# Altium schematic sheet 4.Interface2.SchDoc
size A4; DocumentNumber: 5; SheetNumber: 5; SheetTotal: 6
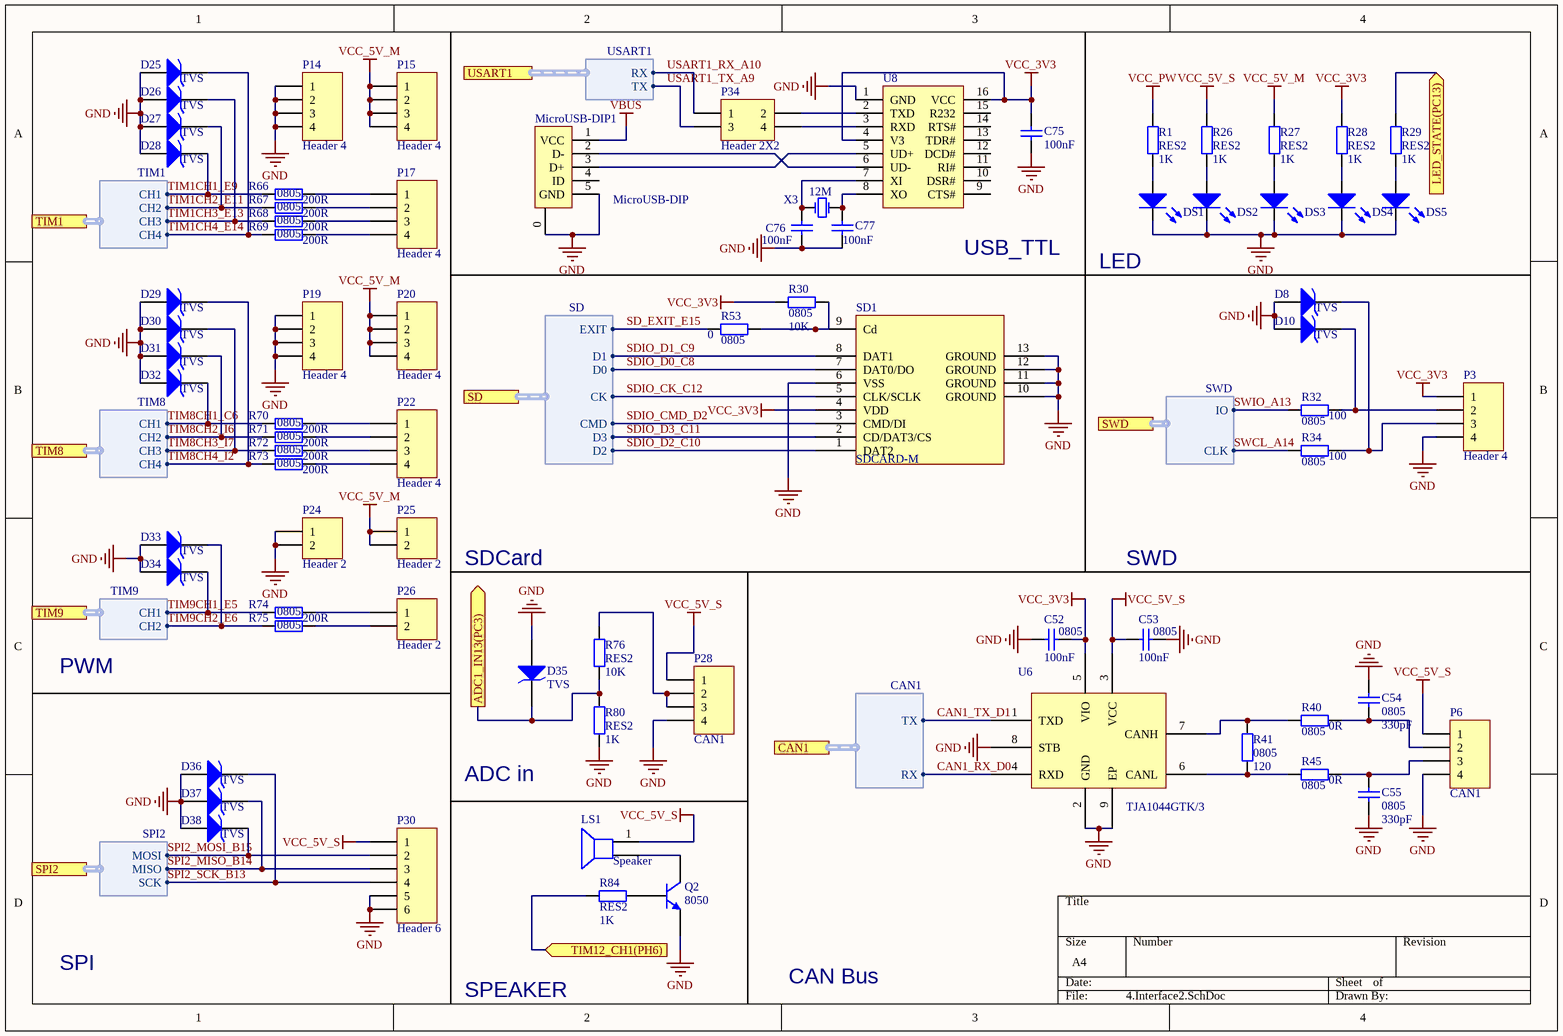
[diagram p0: 4.Interface2.SchDoc]

## Parts
C52  0805  value 100nF  [C 0805_M]
C53  0805  value 100nF  [C 0805_M]
C54  0805  value 330pF  [C 0805_M]
C55  0805  value 330pF  [C 0805_M]
C75  value 100nF  [C 0805_L]  (hidden comment: CAP)
C76  value 100nF  [C 0805_L]  (hidden comment: CAP)
C77  value 100nF  [C 0805_L]  (hidden comment: CAP)
D8  TVS  [SOD-523]
D10  TVS  [SOD-523]
D25  TVS  [SOD-523]
D26  TVS  [SOD-523]
D27  TVS  [SOD-523]
D28  TVS  [SOD-523]
D29  TVS  [SOD-523]
D30  TVS  [SOD-523]
D31  TVS  [SOD-523]
D32  TVS  [SOD-523]
D33  TVS  [SOD-523]
D34  TVS  [SOD-523]
D35  TVS  [SOD-523]
D36  TVS  [SOD-523]
D37  TVS  [SOD-523]
D38  TVS  [SOD-523]
DS1  LED  [LED 0805B]  (value not drawn)
DS2  LED  [LED 0805B]  (value not drawn)
DS3  LED  [LED 0805B]  (value not drawn)
DS4  LED  [LED 0805B]  (value not drawn)
DS5  LED  [LED 0805B]  (value not drawn)
LS1  Speaker  [BEEP 5x9x5.5]
MicroUSB-DIP1  MicroUSB-DIP  [MICRO_USB_DIP]
P3  Header 4  [KF2EDGK-2.54-WI-4P]
P6  CAN1  [KF2EDGK-2.54-WI-4P]
P14  Header 4  [HDR2.54-LI-4P]
P15  Header 4  [HDR2.54-LI-4P]
P17  Header 4  [HDR2.54-LI-4P]
P19  Header 4  [HDR2.54-LI-4P]
P20  Header 4  [HDR2.54-LI-4P]
P22  Header 4  [HDR2.54-LI-4P]
P24  Header 2  [HDR2.54-LI-2P]
P25  Header 2  [HDR2.54-LI-2P]
P26  Header 2  [HDR2.54-LI-2P]
P28  CAN1  [KF2EDGK-2.54-WI-4P]
P30  Header 6  [KF2EDGK-2.54-WI-6P]
P34  Header 2X2  [HDR2.54-LI-2x2P]
Q2  8050  [SOT23-3L]
R1  RES2  value 1K  [R 0805_L]
R26  RES2  value 1K  [R 0805_L]
R27  RES2  value 1K  [R 0805_L]
R28  RES2  value 1K  [R 0805_L]
R29  RES2  value 1K  [R 0805_L]
R30  0805  value 10K  [R 0805_L]
R32  0805  value 100  [R 0805_L]
R34  0805  value 100  [R 0805_L]
R40  0805  value 0R  [R 0805_L]
R41  0805  value 120  [R 0805_L]
R45  0805  value 0R  [R 0805_L]
R53  0805  value 0  [R 0805_L]
R66  0805  value 200R  [R 0805_L]
R67  0805  value 200R  [R 0805_L]
R68  0805  value 200R  [R 0805_L]
R69  0805  value 200R  [R 0805_L]
R70  0805  value 200R  [R 0805_L]
R71  0805  value 200R  [R 0805_L]
R72  0805  value 200R  [R 0805_L]
R73  0805  value 200R  [R 0805_L]
R74  0805  value 200R  [R 0805_L]
R75  0805  [R 0805_L]
R76  RES2  value 10K  [R 0805_L]
R80  RES2  value 1K  [R 0805_L]
R84  RES2  value 1K  [R 0805_L]
SD1  SDCARD-M  [SDCARD-M]
U6  TJA1044GTK/3  [HVSON8]
U8  CH340G  [SOP16_M]  (value not drawn)
X3  12M  [OSC HC-49S]

## Ports
ADC1_IN13(PC3) (out), CAN1 (harness CAN1), LED_STATE(PC13) (in), SD (harness SD), SPI2 (harness SPI2), SWD (harness SWD), TIM1 (harness TIM1), TIM8 (harness TIM8), TIM9 (harness TIM9), TIM12_CH1(PH6) (in), USART1 (harness USART1)

## Harnesses
TIM1: CH1, CH2, CH3, CH4
TIM8: CH1, CH2, CH3, CH4
USART1: RX, TX
TIM9: CH1, CH2
SPI2: MOSI, MISO, SCK
SD: EXIT, D1, D0, CK, CMD, D3, D2
SWD: IO, CLK
CAN1: TX, RX

## Nets
GND: C52.1 C53.2 C54.2 C55.1 C75.1 C76.1 C77.1 D8.1(A) D10.1(A) D25.1(A) D26.1(A) D27.1(A) D28.1(A) D29.1(A) D30.1(A) D31.1(A) D32.1(A) D33.1(A) D34.1(A) D35.1(A) D36.1(A) D37.1(A) D38.1(A) DS1.2(K) DS2.2(K) DS3.2(K) DS4.2(K) DS5.2(K) MicroUSB-DIP1.0 MicroUSB-DIP1.5(GND) P3.4 P6.4 P14.1 P14.2 P14.3 P14.4 P19.1 P19.2 P19.3 P19.4 P24.1 P24.2 P28.4 P30.5 P30.6 Q2.2(E) R80.1 SD1.6(VSS) SD1.10(GROUND) SD1.11(GROUND) SD1.12(GROUND) SD1.13(GROUND) U6.2(GND) U6.8(STB) U6.9(EP) U8.1(GND)
VBUS: MicroUSB-DIP1.1(VCC)
VCC_3V3: C52.2 C75.2 P3.1 R28.2 R30.2 SD1.4(VDD) U6.5(VIO) U8.4(V3) U8.16(VCC)
VCC_5V_M: P15.1 P15.2 P15.3 P15.4 P20.1 P20.2 P20.3 P20.4 P25.1 P25.2 R27.2
VCC_5V_S: C53.1 LS1.1 P6.1 P28.1 P30.1 R26.2 U6.3(VCC)
VCC_PW: R1.2
ADC1_IN13(PC3): D35.2(K) R76.1 R80.2 ; port ADC1_IN13(PC3)
CAN1_RX_D0: U6.4(RXD) ; port CAN1.RX
CAN1_TX_D1: U6.1(TXD) ; port CAN1.TX
LED_STATE(PC13): R29.2 ; port LED_STATE(PC13)
SD_EXIT_E15: R53.1 ; port SD.EXIT
SDIO_CK_C12: SD1.5(CLK/SCLK) ; port SD.CK
SDIO_CMD_D2: SD1.3(CMD/DI) ; port SD.CMD
SDIO_D0_C8: SD1.7(DAT0/DO) ; port SD.D0
SDIO_D1_C9: SD1.8(DAT1) ; port SD.D1
SDIO_D2_C10: SD1.1(DAT2) ; port SD.D2
SDIO_D3_C11: SD1.2(CD/DAT3/CS) ; port SD.D3
SPI2_MISO_B14: D37.2(K) P30.3 ; port SPI2.MISO
SPI2_MOSI_B15: D38.2(K) P30.2 ; port SPI2.MOSI
SPI2_SCK_B13: D36.2(K) P30.4 ; port SPI2.SCK
SWCL_A14: R34.1 ; port SWD.CLK
SWIO_A13: R32.1 ; port SWD.IO
TIM1CH1_E9: D28.2(K) R66.1 ; port TIM1.CH1
TIM1CH2_E11: D27.2(K) R67.1 ; port TIM1.CH2
TIM1CH3_E13: D26.2(K) R68.1 ; port TIM1.CH3
TIM1CH4_E14: D25.2(K) R69.1 ; port TIM1.CH4
TIM8CH1_C6: D32.2(K) R70.1 ; port TIM8.CH1
TIM8CH2_I6: D31.2(K) R71.1 ; port TIM8.CH2
TIM8CH3_I7: D30.2(K) R72.1 ; port TIM8.CH3
TIM8CH4_I2: D29.2(K) R73.1 ; port TIM8.CH4
TIM9CH1_E5: D34.2(K) R74.1 ; port TIM9.CH1
TIM9CH2_E6: D33.2(K) R75.1 ; port TIM9.CH2
TIM12_CH1(PH6): R84.2 ; port TIM12_CH1(PH6)
USART1_RX_A10: P34.1 ; port USART1.RX
USART1_TX_A9: P34.3 ; port USART1.TX
NetC54_1: C54.1 P6.2 R40.1
NetC55_2: C55.2 P6.3 R45.1
NetC76_2: C76.2 U8.7(XI) X3.1(OSC1)
NetC77_2: C77.2 U8.8(XO) X3.2(OSC2)
NetD8_2: D8.2(K) P3.3 R34.2
NetD10_2: D10.2(K) P3.2 R32.2
NetDS1_1: DS1.1(A) R1.1
NetDS2_1: DS2.1(A) R26.1
NetDS3_1: DS3.1(A) R27.1
NetDS4_1: DS4.1(A) R28.1
NetDS5_1: DS5.1(A) R29.1
NetLS1_2: LS1.2 Q2.3(C)
NetMicroUSB-DIP1_2: MicroUSB-DIP1.2(D-) U8.6(UD-)
NetMicroUSB-DIP1_3: MicroUSB-DIP1.3(D+) U8.5(UD+)
NetP17_1: P17.1 R66.2
NetP17_2: P17.2 R67.2
NetP17_3: P17.3 R68.2
NetP17_4: P17.4 R69.2
NetP22_1: P22.1 R70.2
NetP22_2: P22.2 R71.2
NetP22_3: P22.3 R72.2
NetP22_4: P22.4 R73.2
NetP26_1: P26.1 R74.2
NetP26_2: P26.2 R75.2
NetP28_2: P28.2 P28.3 R76.2
NetP34_2: P34.2 U8.2(TXD)
NetP34_4: P34.4 U8.3(RXD)
NetQ2_1: Q2.1(B) R84.1
NetR30_1: R30.1 R53.2 SD1.9(Cd)
NetR40_2: R40.2 R41.2 U6.7(CANH)
NetR41_1: R41.1 R45.2 U6.6(CANL)

Not connected (* = marked no-connect by the designer): MicroUSB-DIP1 4(ID); U8 9(CTS#) 10(DSR#) 11(RI#) 12(DCD#) 13(TDR#) 14(RTS#) 15(R232)

## Notes on the sheet
- USB_TTL
- (near DS1) LED
- SDCard
- SWD
- PWM
- ADC in
- SPI
- CAN Bus
- SPEAKER

## Library data of the parts
C52-C55 = CAP
D8 D10 D25-D38 = D: High Conductance Fast Diode; Published: 8-Jun-2000; LatestRevisionDate: 17-Jul-2002; LatestRevisionNote: Re-released for DXP Platform.; DatasheetVersion: 1997; PackageReference: DO-35; Publisher: Altium Limited; PackageDescription: Diode, Axial; Body 3.8 x 1.9 mm (LxDia. max), Lead Dia. 0.53 mm (max); Code_JEDEC: DO-204-AH; ComponentLink1Description: Manufacturer Link; ComponentLink1URL: http://www.fairchildsemi.com/; ComponentLink2Description: Datasheet; ComponentLink2URL: http://www.fairchildsemi.com/ds/1N%2F1N4148.pdf
LS1 = Speaker: Loudspeaker; Published: 24-Mar-1999; LatestRevisionDate: 17-Jul-2002; LatestRevisionNote: Re-released for DXP Platform.; PackageReference: PIN2; Publisher: Altium Limited
P3 P6 P14 P15 P17 P19 P20 P22 P28 = Header 4: Header, 4-Pin; LatestRevisionDate: 17-Jul-2002; LatestRevisionNote: Re-released for DXP Platform.; Publisher: Altium Limited
P24-P26 = Header 2: Header, 2-Pin; LatestRevisionDate: 17-Jul-2002; LatestRevisionNote: Re-released for DXP Platform.; Publisher: Altium Limited
P30 = Header 6: Header, 6-Pin; LatestRevisionDate: 17-Jul-2002; LatestRevisionNote: Re-released for DXP Platform.; Publisher: Altium Limited
P34 = Header 2X2: Header, 2-Pin, Dual row; LatestRevisionDate: 17-Jul-2002; LatestRevisionNote: Re-released for DXP Platform.; Publisher: Altium Limited
Q2 = NPN  SOT: NPN Bipolar Transistor; Published: 8-Jun-2000; LatestRevisionDate: 17-Jul-2002; LatestRevisionNote: Re-released for DXP Platform.; PackageReference: TO-226-AA; Publisher: Altium Limited; PackageDescription: TO, Flat Index; 3 In-Line, Axial Leads; Body Dia. 4.8mm; Leads 0.55 x 0.51 mm (max); Code_JEDEC: TO-226-AA
R1 R26-R30 R32 R34 R40 R41 R45 R53 R66-R76 R80 R84 = RES2: Resistor; Published: 8-Jun-2000; LatestRevisionDate: 17-Jul-2002; LatestRevisionNote: Re-released for DXP Platform.; PackageReference: AXIAL-0.3; Publisher: Altium Limited; PackageDescription: Axial Device, Thru-Hole; 2 Leads; 0.3 in Pin Spacing
SD1 = SDCARD-M: TF卡槽
X3 = YX